# EAGLE design LaunchController1 (EAGLE 9.6.2)
COMPANY: WILKUS ELEKTRONIKS; DOCUMENT_NUMBER: 2050N-23-1; REVISION: B
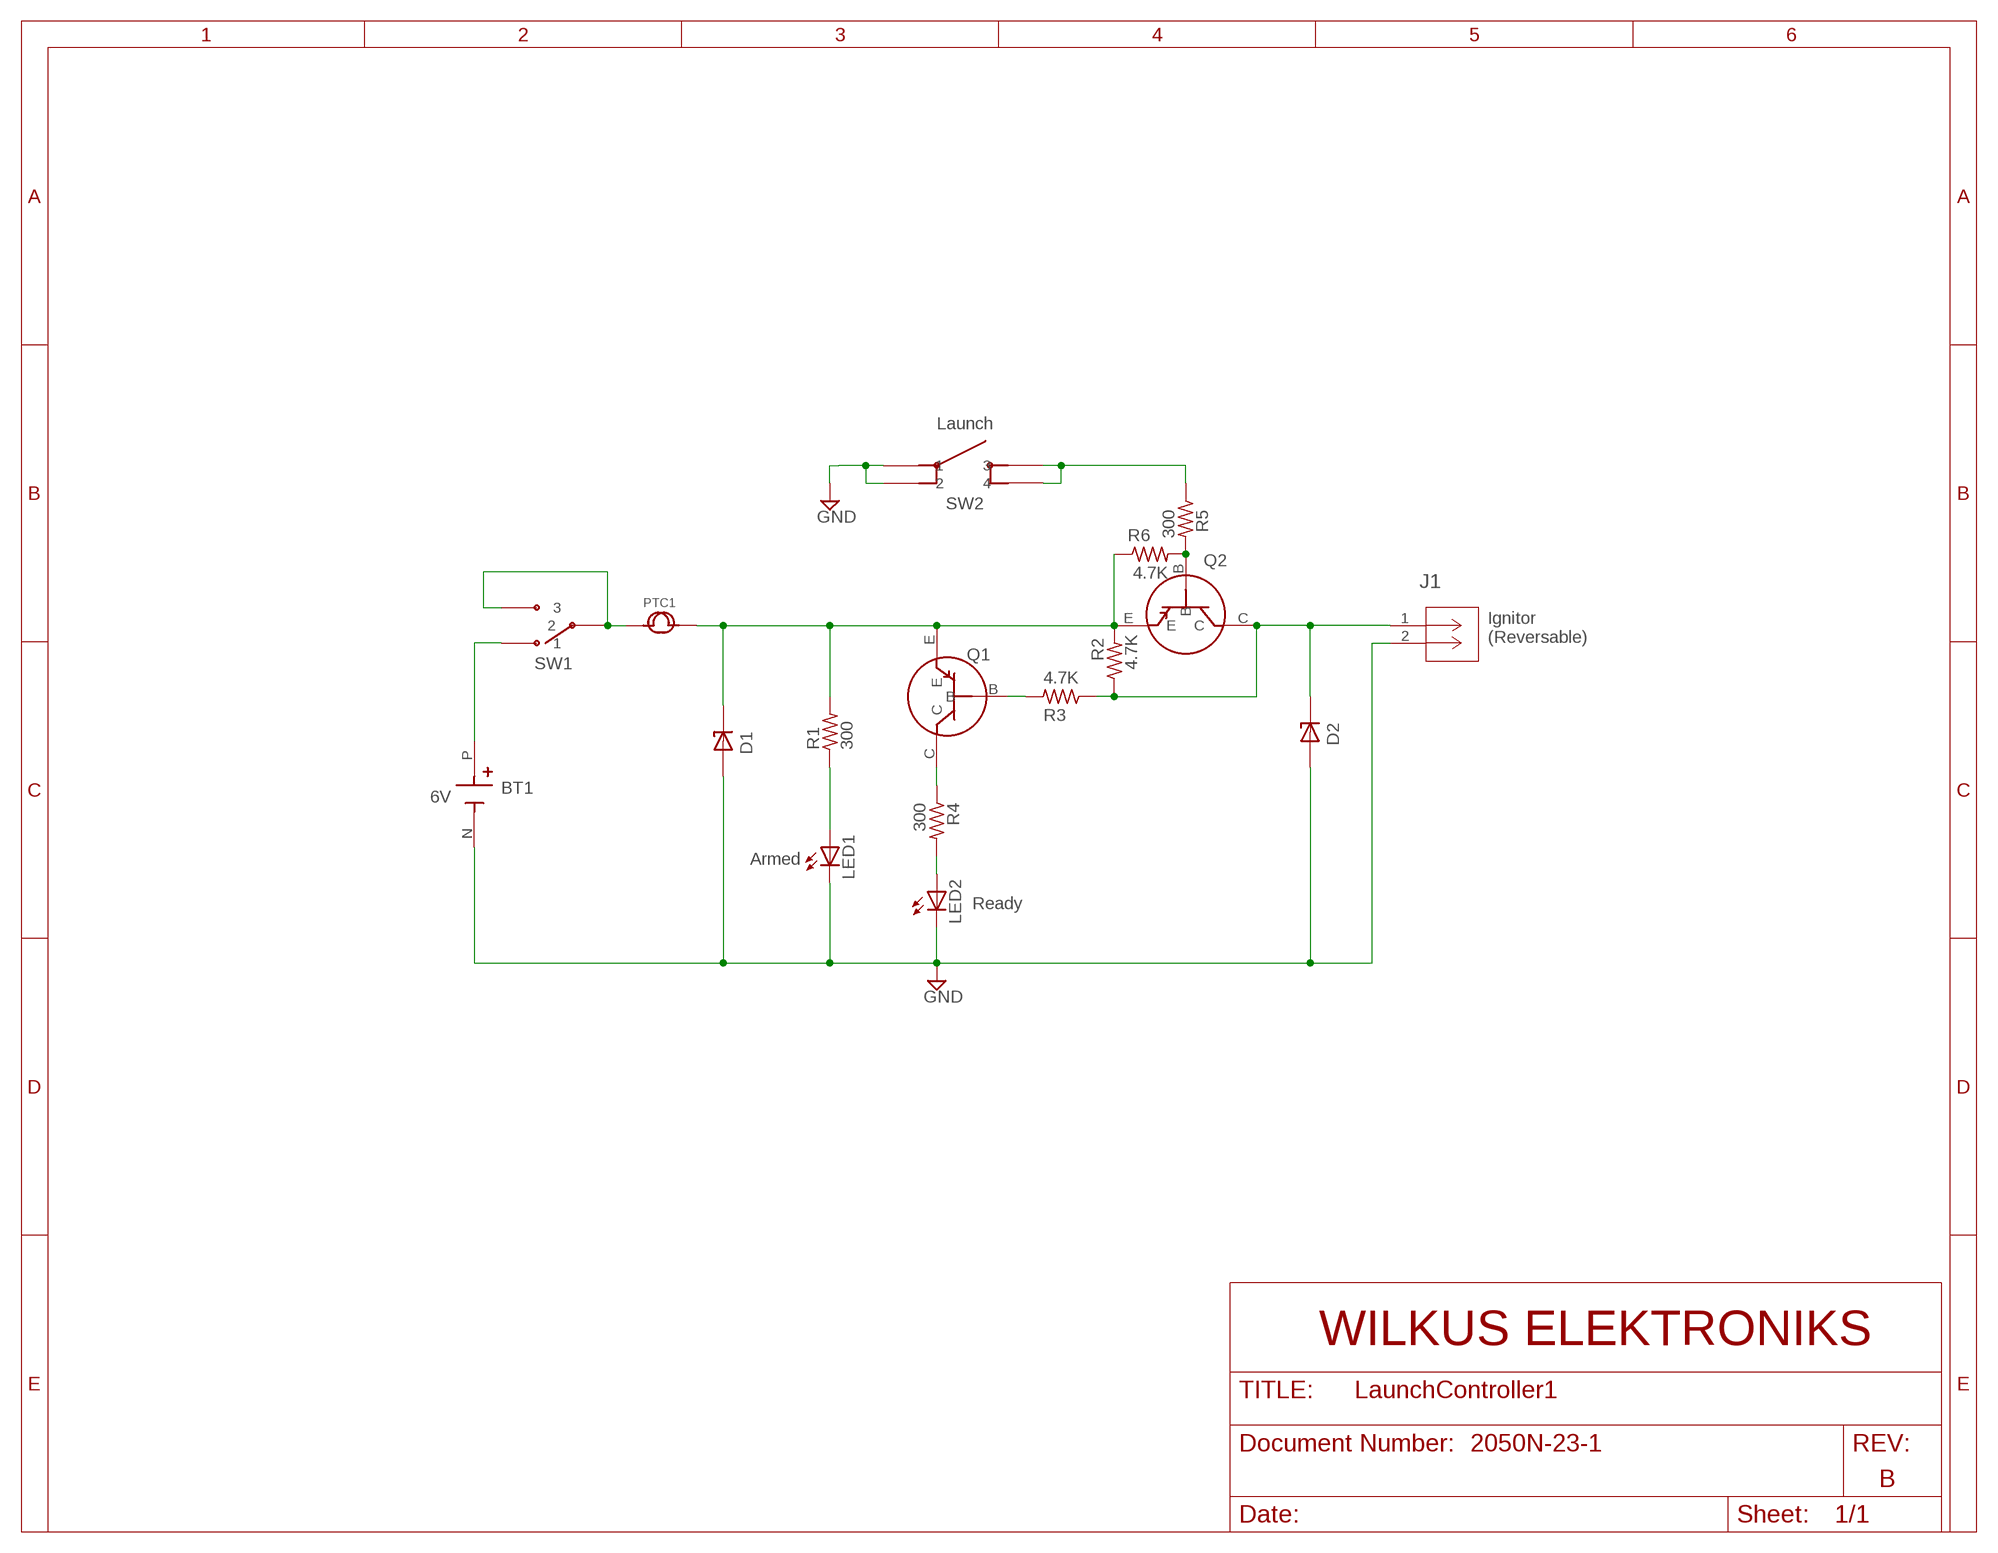
[diagram p0: schematic, sheet 1]

## Parts
BT1  6V  2477  [BAT_2477]
D1  P6KE75CA  [DIOAD1300W80L670D310]
D2  P6KE75CA  [DIOAD1300W80L670D310]
J1  691137710002  [CONN2_710002_WRE]
LED1  LED5MM  [LED5MM]
LED2  LED5MM  [LED5MM]
PTC1  0ZRG0120FF2E  [0ZRG]
Q1  BJT_PNP  [TO92-]
Q2  BJT_PNP  [TO92-]
R1  300  RES_0.5W_TH  [0309/12]
R2  4.7K  RES_0.5W_TH  [0309/12]
R3  4.7K  RES_0.5W_TH  [0309/12]
R4  300  RES_0.5W_TH  [0309/12]
R5  300  RES_0.5W_TH  [0309/12]
R6  4.7K  RES_0.5W_TH  [0309/12]
SW1  ANT11SF1CQE  [ANT11SF1CQE]
SW2  D6R40F2LFS  [D6R40F2LFS]

## Nets
GND: BT1.N(NEG) D1.A D2.A J1.2 LED1.K(C) LED2.K(C) SW2.P$1 SW2.P$2
IGNTR_HOT: D2.C J1.1 Q2.C R2.1 R3.1
N$1: Q1.B R3.2
N$2: PTC1.1 SW1.P$2 SW1.P$3
N$3: Q2.B R5.2 R6.2
N$5: LED1.A R1.1
N$8: R5.1 SW2.P$3 SW2.P$4
N$10: D1.C PTC1.2 Q1.E Q2.E R1.2 R2.2 R6.1
N$11: LED2.A R4.2
N$12: Q1.C R4.1
PWR: BT1.P(POS) SW1.P$1

## Notes on the sheet
- Launch
- Ignitor
  (Reversable)
- Armed
- Ready

## Library data of the parts
BT1 = 2477:2477: Check availability <https://pricing.snapeda.com/parts/2477/Keystone%20Electronics/view-part?ref=eda>; AVAILABILITY: In Stock; DESCRIPTION: Holder For 4 AA Cells-in Series-Plastic; MF: Keystone Electronics; MP: 2477; PACKAGE: None; PRICE: None; PURCHASE-URL: https://pricing.snapeda.com/search/part/2477/?ref=eda
D1 D2 = P6KE75CA:P6KE75CA: Check availability <https://pricing.snapeda.com/parts/P6KE75CA/Littelfuse%20Inc./view-part?ref=eda>; AVAILABILITY: In Stock; DESCRIPTION: 103V Clamp 5.9A Ipp Tvs Diode Through Hole DO-204AC (DO-15); MF: Littelfuse Inc.; MP: P6KE75CA; PACKAGE: SURMETIC 40-2 ON Semiconductor; PRICE: None; PURCHASE-URL: https://pricing.snapeda.com/search/part/P6KE75CA/?ref=eda
J1 = LaunchController1:691137710002; COPYRIGHT: Copyright (C) 2023 Ultra Librarian. All rights reserved.; MANUFACTURER_PART_NUMBER: 691137710002; MFR_NAME: Wurth Electronics
LED1 LED2 = LaunchController1:LED: LED OSRAM: - CHIPLED LG R971, LG N971, LY N971, LG Q971, LY Q971, LO R971, LY R971 LH N974, LH R974 LS Q976, LO Q976, LY Q976 LO Q996 - Hyper CHIPLED LW Q18S LB Q993, LB Q99A, LB R99A - SideLED LS A670, LO A670, LY A670, LG A670, LP A670 LB A673, LV A673, LT A673, LW A673 LH A674 LY A675 LS A676, LA A676, LO A676, LY A676, LW A676 LS A679, LY A679, LG A679 - Hyper Micro SIDELED® LS Y876, LA Y876, LO Y876, LY Y876 LT Y87S - SmartLED LW L88C, LW L88S LB L89C, LB L89S, LG L890 LS L89K, LO L89K, LY L89K LS L896, LA L896, LO L896, LY L896 - TOPLED LS T670, LO T670, LY T670, LG T670, LP T670 LSG T670, LSP T670, LSY T670, LOP T670, LYG T670 LG T671, LOG T671, LSG T671 LB T673, LV T673, LT T673, LW T673 LH T674 LS T676, LA T676, LO T676, LY T676, LB T676, LH T676, LSB T676, LW T676 LB T67C, LV T67C, LT T67C, LS T67K, LO T67K, LY T67K, LW E67C LS E67B, LA E67B, LO E67B, LY E67B, LB E67C, LV E67C, LT E67C LW T67C LS T679, LY T679, LG T679 LS T770, LO T770, LY T770, LG T770, LP T770 LB T773, LV T773, LT T773, LW T773 LH T774 LS E675, LA E675, LY E675, LS T675 LS T776, LA T776, LO T776, LY T776, LB T776 LHGB T686 LT T68C, LB T68C - Hyper Mini TOPLED® LB M676 - Mini TOPLED Santana® LG M470 LS M47K, LO M47K, LY M47K Source: http://www.osram.convergy.de LUXEON: - LUMILED® LXK2-PW12-R00, LXK2-PW12-S00, LXK2-PW14-U00, LXK2-PW14-V00 LXK2-PM12-R00, LXK2-PM12-S00, LXK2-PM14-U00 LXK2-PE12-Q00, LXK2-PE12-R00, LXK2-PE12-S00, LXK2-PE14-T00, LXK2-PE14-U00 LXK2-PB12-K00, LXK2-PB12-L00, LXK2-PB12-M00, LXK2-PB14-N00, LXK2-PB14-P00, LXK2-PB14-Q00 LXK2-PR12-L00, LXK2-PR12-M00, LXK2-PR14-Q00, LXK2-PR14-R00 LXK2-PD12-Q00, LXK2-PD12-R00, LXK2-PD12-S00 LXK2-PH12-R00, LXK2-PH12-S00 LXK2-PL12-P00, LXK2-PL12-Q00, LXK2-PL12-R00 Source: www.luxeon.com KINGBRIGHT: KA-3528ASYC Source: www.kingbright.com
PTC1 = LaunchController1:0ZRG0120FF2E
Q1 Q2 = LaunchController1:BJT_PNP
R1-R6 = LaunchController1:RES_0.5W_TH
SW1 = LaunchController1:ANT11SF1CQE
SW2 = LaunchController1:D6R40F2LFS

## Board
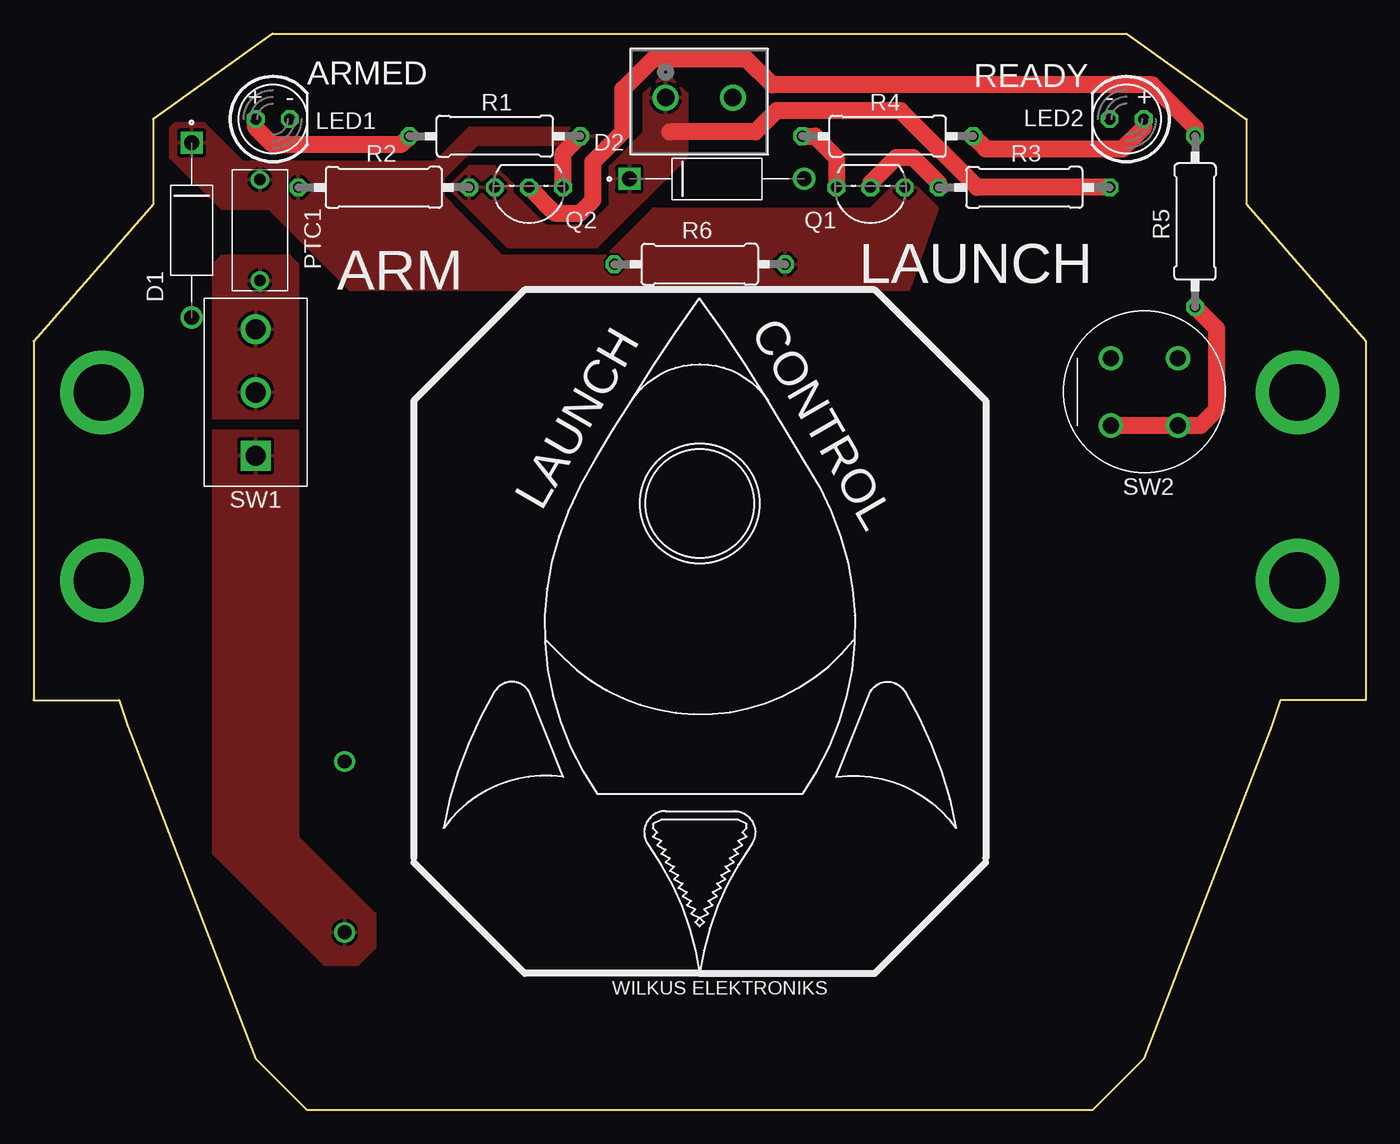
[diagram p1: board, top side]
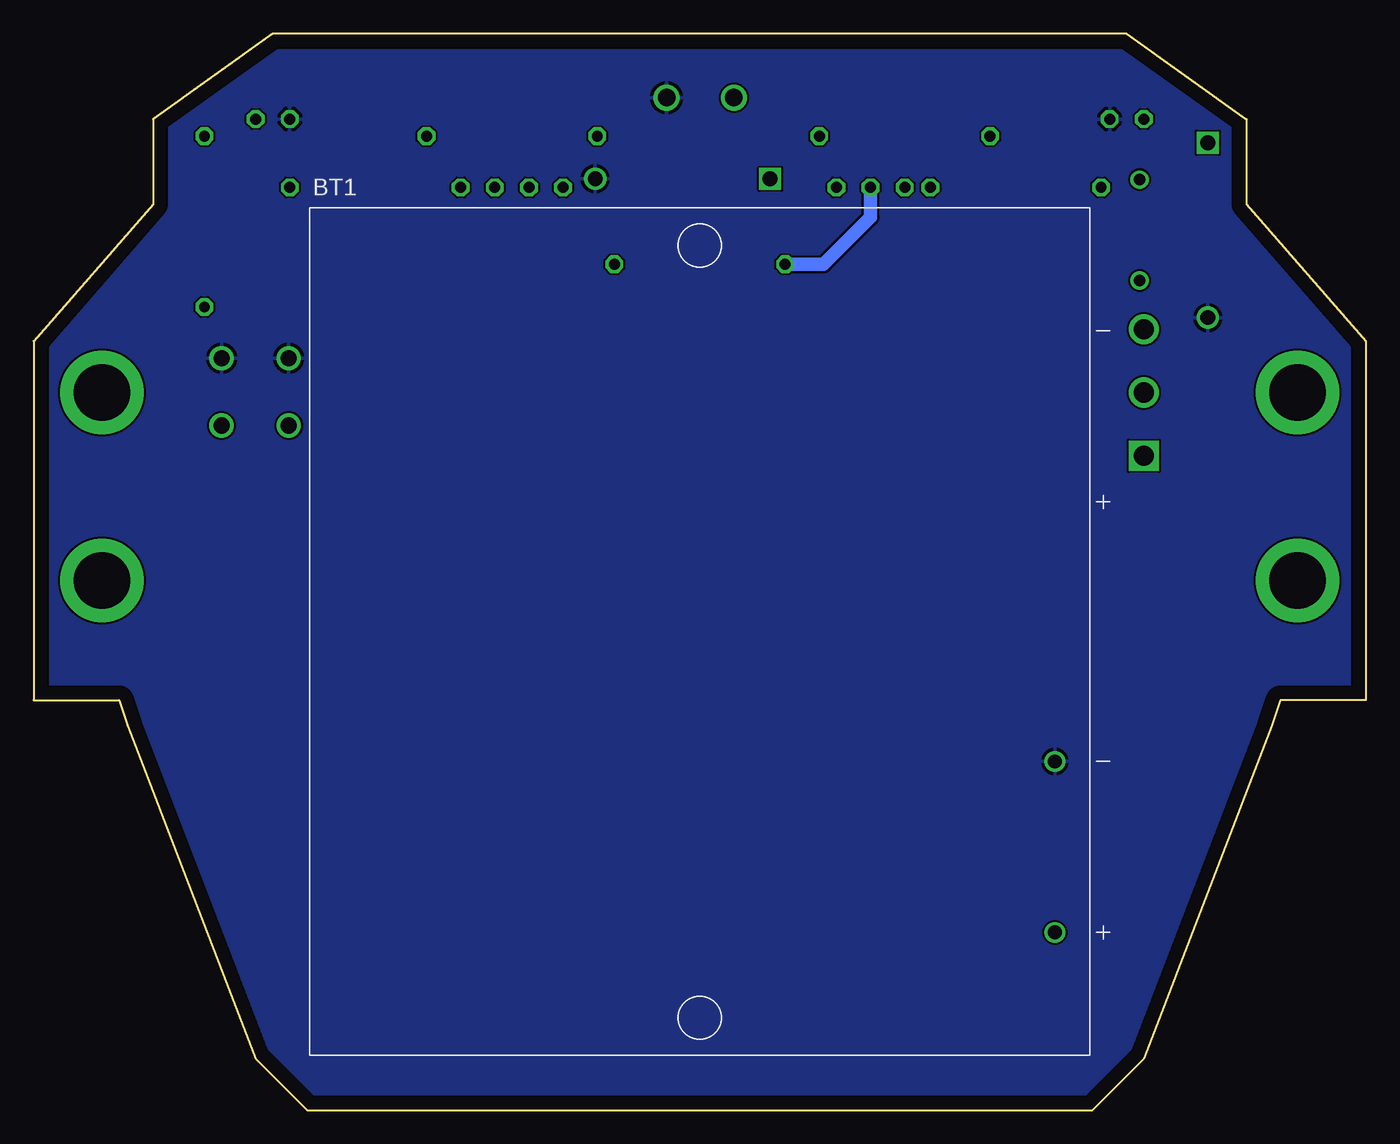
[diagram p2: board, bottom side, seen from below]

Size 99.06 x 80.01 mm. Coordinates in mm from the lower left corner, seen from the top.
Outline: 17.78,80.01 8.89,73.66 8.89,67.31 0,57.15 0,30.48 6.35,30.48 6.99,28.57 16.51,3.81 20.32,0 78.74,0 82.55,3.81 92.08,28.57 92.71,30.48 99.06,30.48 99.06,57.15 90.17,67.31 90.17,73.66 81.28,80.01 17.78,80.01
Copper layers (1*16): Top 0.035mm / dielectric 1.5mm / Bottom 0.035mm
Design rules "default": minimum track width 6mil, minimum drill 0.35mm, track to track 6mil, track to pad 6mil, pad to pad 6mil, via to via 6mil, smd to smd 6mil, copper to edge 40mil, drill to drill 6mil, minimum pad ring 10mil, minimum via ring 8mil, stop-mask expansion 4mil, vias tented up to drill 0mil, thermal gap 10mil

### Footprints (pad centres in the part's own frame; a part is rotated, then mirrored left to right if it is on the bottom)
BAT_2477 = drill 1.02: N 26.405,-9.65; P 26.405,-22.35
DIOAD1300W80L670D310 = drill 1.1: A 6.5,0 | drill 1.1 square: C -6.5,0
CONN2_710002_WRE = drill 1.295 pad 1.803: 1 0,0; 2 5.004,0
LED5MM = drill 0.813 octagon: A -1.27,0; K 1.27,0
0ZRG = drill 0.85: 1 -3.75,0; 2 3.75,0
TO92- = drill 0.813 octagon: B 0,0; C 2.54,0; E -2.54,0
0309/12 = drill 0.813 octagon: 1 -6.35,0; 2 6.35,0
ANT11SF1CQE = drill 1.5 square: P$1 0,4.7 | drill 1.5: P$2 0,0; P$3 0,-4.7
D6R40F2LFS = drill 1.2: P$1 0,0; P$2 0,-5; P$3 5,0; P$4 5,-5

### Placement (x,y rotation side)
BT1  49.53,35.56 0 bottom
D1  11.75,65.41 270 top
D2  50.8,69.22 0 top
J1  46.99,75.25 0 top
LED1  17.78,73.66 0 top
LED2  81.28,73.66 180 top
PTC1  16.83,65.41 90 top
Q1  62.23,68.58 180 top
Q2  36.83,68.58 180 top
R1  34.29,72.39 0 top
R2  26.04,68.58 180 top
R3  73.66,68.58 180 top
R4  63.5,72.39 0 top
R5  86.36,66.04 90 top
R6  49.53,62.87 180 top
SW1  16.51,53.34 180 top
SW2  85.09,55.88 270 top

### Tracks (layer width: path | path; a pad name or v marks a point on that pad's centre or on a via)
GND
  pour Bottom: 0.32,57.15 0.32,30.8 6.35,30.8 8.57,25.72 16.83,4.13 20.64,0.32 78.42,0.32 82.23,4.13 90.17,25.08 89.85,25.4 92.71,31.11 98.42,31.11 98.42,56.83 89.54,66.99 89.54,73.34 81.28,79.38 18.1,79.38 9.53,73.66 9.21,73.34 9.21,66.99
IGNTR_HOT
  Top 1.27: R3.1 70.17,68.58 64.45,74.3 55.24,74.3 53.66,72.71 47.31,72.71
  pour Top: 31.11,68.26 35.24,64.14 41.91,64.14 48.58,70.8 48.58,75.56 47.31,76.83 46.67,76.83 45.4,75.56 45.4,72.71 42.86,70.17 42.86,67.31 41.27,65.72 38.1,65.72 35.56,68.26 35.56,68.9 34.29,70.17 32.38,70.17 31.11,68.9
N$1
  Top 1.27: R3.2 67.31,68.9 65.41,70.8 64.14,70.8 62.23,68.9 Q1.B
N$2
  pour Top: 13.97,63.5 19.05,63.5 19.68,62.87 19.68,51.44 13.34,51.44 13.34,62.87
N$3
  Top 1.27: Q2.B 38.73,66.67 40.64,66.67 41.59,67.63 41.59,70.48 43.81,72.71 43.81,75.88 46.04,78.11 53.02,78.11 54.93,76.2 83.19,76.2 86.36,73.03 R5.2
  Bottom 1.016: R6.2 40.32,62.87 36.83,66.36 Q2.B
N$5
  Top 1.27: LED1.A 16.51,73.03 17.78,71.75 27.3,71.75 R1.1
N$8
  Top 1.27: R5.1 87.95,58.1 87.95,52.07 86.76,50.88 SW2.P$3 SW2.P$4
N$10
  Top 1.27: Q2.E 39.37,71.12 R1.2
  pour Top: 10.16,73.03 10.16,70.8 13.97,66.99 17.46,66.99 23.5,60.96 65.09,60.96 67.23,67.07 65.09,69.22 64.45,69.22 62.23,66.99 46.04,66.99 42.54,63.5 34.85,63.5 31.75,66.67 30.48,67.94 30.48,69.22 33.02,71.75 41.27,71.75 41.59,72.07 41.59,73.03 32.38,73.03 29.84,70.48 15.56,70.48 12.7,73.34 10.48,73.34
N$11
  Top 1.27: R4.2 70.8,71.44 80.96,71.44 82.55,73.03 LED2.A
N$12
  Top 1.27: R4.1 58.1,72.39 59.69,70.8 Q1.C
N$13  (via drill 4.22 pad 6.2)
  other vias: 5.08,53.34
N$14  (via drill 4.22 pad 6.2)
  other vias: 5.08,39.37
N$15  (via drill 4.22 pad 6.2)
  other vias: 93.98,53.34
N$16  (via drill 4.22 pad 6.2)
  other vias: 93.98,39.37
PWR
  pour Top: 19.68,50.48 13.34,50.48 13.34,19.05 21.59,10.79 24.13,10.79 25.4,12.06 25.4,14.61 19.68,20.32

### Text on the board
tPlace: READY | ARMED | LAUNCH | ARM | LAUNCH | CONTROL | WILKUS ELEKTRONIKS
tNames: + - | - +